# Altium schematic sheet Connectors.SchDoc: Connectors
size A4; Revision: 1.0; SheetNumber: 2; SheetTotal: 11; Class: B
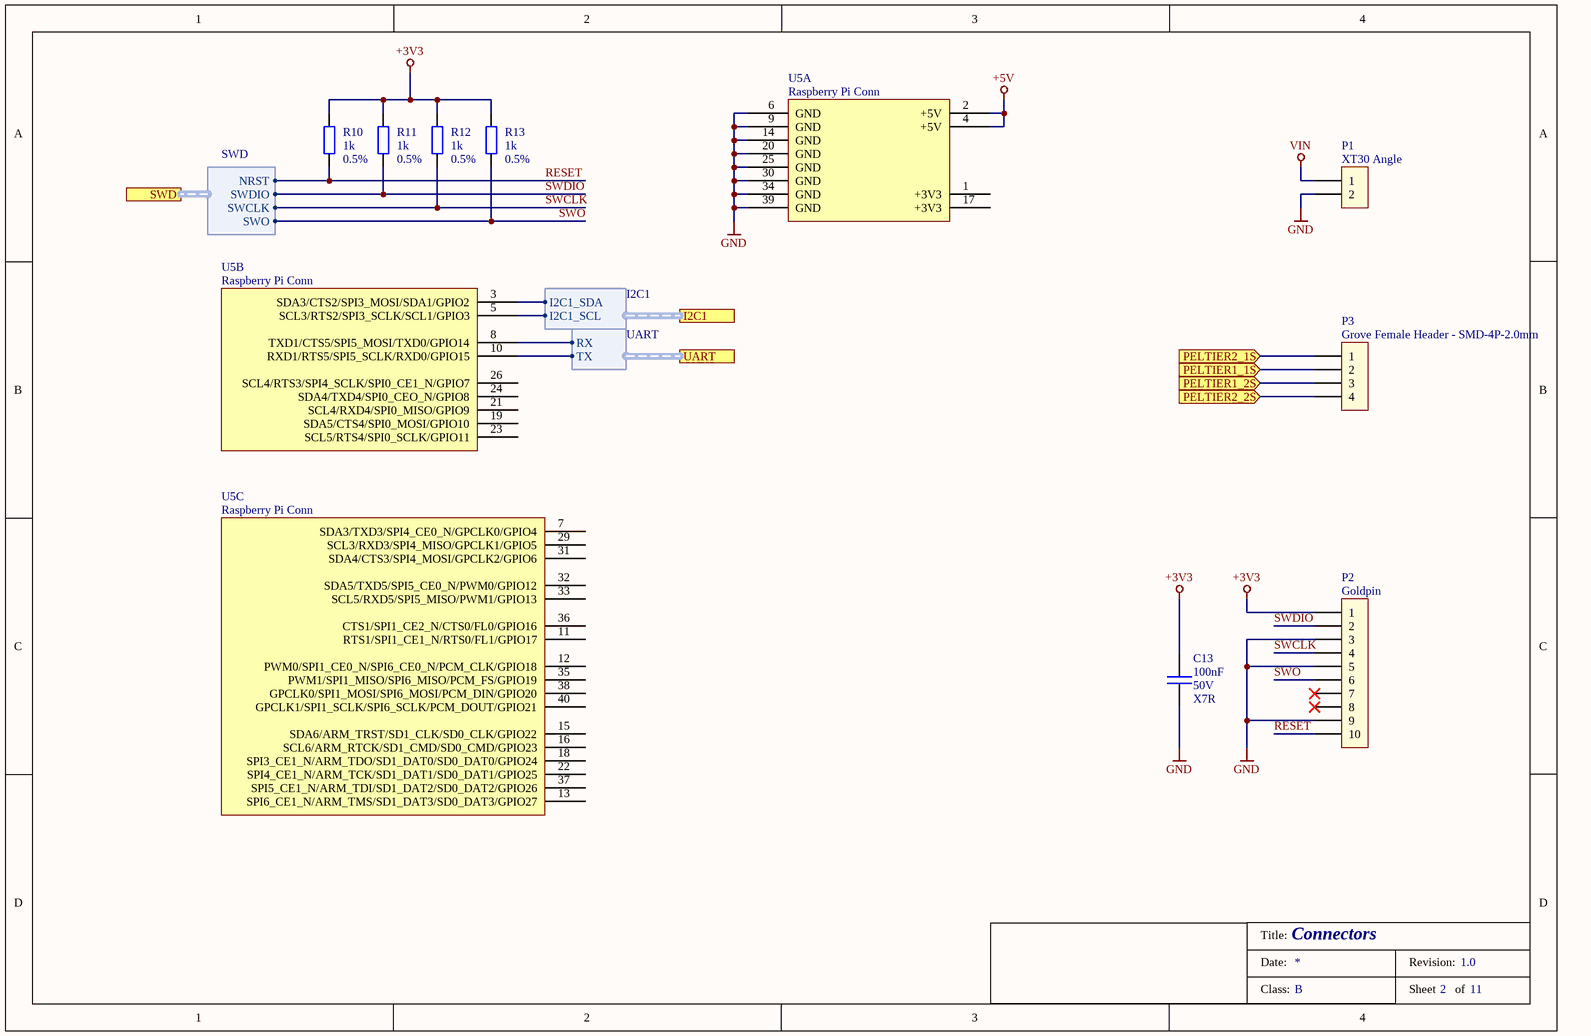
[diagram p0: Connectors.SchDoc]

## Parts
C13  value 100nF  Voltage: 50V  Dielectric: X7R  [C_0603]  (hidden comment: C)
P1  P_Header_2  [XT30_ANGL]  (value not drawn)
P2  P_Header_10  [CONN_M50_3610542]  (value not drawn)
P3  P_Header_4  [CONN_114020164]  (value not drawn)
R10  value 1k  Tolerance: 0.5%  [R_0402]  (hidden comment: R)
R11  value 1k  Tolerance: 0.5%  [R_0402]  (hidden comment: R)
R12  value 1k  Tolerance: 0.5%  [R_0402]  (hidden comment: R)
R13  value 1k  Tolerance: 0.5%  [R_0402]  (hidden comment: R)
U5  value Raspberry Pi Conn  [CONN_Raspberry_Pi]  (hidden comment: M_Raspberry_Pi_4B)  (parts A,B,C of 3)

## Ports
I2C1 (harness I2C1), PELTIER1_1S (in), PELTIER1_2S (in), PELTIER2_1S (in), PELTIER2_2S (in), SWD (harness SWD), UART (harness UART)

## Harnesses
SWD: NRST, SWDIO, SWCLK, SWO
UART: TX, RX
I2C1: I2C1_SCL, I2C1_SDA

## Nets
+3V3: C13.1 P2.1 R10.1 R11.1 R12.1 R13.1
+5V: U5.2(+5V) U5.4(+5V)
GND: C13.2 P1.2 P2.3 P2.5 P2.9 U5.6(GND) U5.9(GND) U5.14(GND) U5.20(GND) U5.25(GND) U5.30(GND) U5.34(GND) U5.39(GND)
VIN: P1.1
PELTIER1_1S: P3.2 ; port PELTIER1_1S
PELTIER1_2S: P3.3 ; port PELTIER1_2S
PELTIER2_1S: P3.1 ; port PELTIER2_1S
PELTIER2_2S: P3.4 ; port PELTIER2_2S
RESET: P2.10 R10.2 ; port SWD.NRST
SWCLK: P2.4 R12.2 ; port SWD.SWCLK
SWDIO: P2.2 R11.2 ; port SWD.SWDIO
SWO: P2.6 R13.2 ; port SWD.SWO
NetU5_3: U5.3(SDA3/CTS2/SPI3_MOSI/SDA1/GPIO2) ; port I2C1.I2C1_SDA
NetU5_5: U5.5(SCL3/RTS2/SPI3_SCLK/SCL1/GPIO3) ; port I2C1.I2C1_SCL
NetU5_8: U5.8(TXD1/CTS5/SPI5_MOSI/TXD0/GPIO14) ; port UART.RX
NetU5_10: U5.10(RXD1/RTS5/SPI5_SCLK/RXD0/GPIO15) ; port UART.TX

Not connected (* = marked no-connect by the designer): P2 7* 8*; U5 1(+3V3) 7(SDA3/TXD3/SPI4_CE0_N/GPCLK0/GPIO4) 11(RTS1/SPI1_CE1_N/RTS0/FL1/GPIO17) 12(PWM0/SPI1_CE0_N/SPI6_CE0_N/PCM_CLK/GPIO18) 13(SPI6_CE1_N/ARM_TMS/SD1_DAT3/SD0_DAT3/GPIO27) 15(SDA6/ARM_TRST/SD1_CLK/SD0_CLK/GPIO22) 16(SCL6/ARM_RTCK/SD1_CMD/SD0_CMD/GPIO23) 17(+3V3) 18(SPI3_CE1_N/ARM_TDO/SD1_DAT0/SD0_DAT0/GPIO24) 19(SDA5/CTS4/SPI0_MOSI/GPIO10) 21(SCL4/RXD4/SPI0_MISO/GPIO9) 22(SPI4_CE1_N/ARM_TCK/SD1_DAT1/SD0_DAT1/GPIO25) 23(SCL5/RTS4/SPI0_SCLK/GPIO11) 24(SDA4/TXD4/SPI0_CEO_N/GPIO8) 26(SCL4/RTS3/SPI4_SCLK/SPI0_CE1_N/GPIO7) 29(SCL3/RXD3/SPI4_MISO/GPCLK1/GPIO5) 31(SDA4/CTS3/SPI4_MOSI/GPCLK2/GPIO6) 32(SDA5/TXD5/SPI5_CE0_N/PWM0/GPIO12) 33(SCL5/RXD5/SPI5_MISO/PWM1/GPIO13) 35(PWM1/SPI1_MISO/SPI6_MISO/PCM_FS/GPIO19) 36(CTS1/SPI1_CE2_N/CTS0/FL0/GPIO16) 37(SPI5_CE1_N/ARM_TDI/SD1_DAT2/SD0_DAT2/GPIO26) 38(GPCLK0/SPI1_MOSI/SPI6_MOSI/PCM_DIN/GPIO20) 40(GPCLK1/SPI1_SCLK/SPI6_SCLK/PCM_DOUT/GPIO21)

## Notes on the sheet
- Title:
- Date:
- Revision:
- Class:
- Sheet
- of

## Library data of the parts
C13 = C_100nF_50V_0603: Capacitor; Manufacturer: Kemet; Manufacturer Part Number: C0603T104K5RCL7136; Tmax: 125; Tmin: -55; Grade: 2; Fail Rate: A; Tolerance: 10%; Part Number: C_100nF_50V_0603; HelpURL: https://content.kemet.com/datasheets/KEM_C1027_X7R_COTS_SMD.pdf; Supplier 1: Digi-Key; Supplier Part Number 1: 399-6305-1-ND; Status: Active
P1 = XT30-ANGLE: XT30 Angle; Manufacturer: DFRobot; Manufacturer Part Number: XT30PW-M; Grade: 3; Value: XT30 Angle; Desc: XT30 Angle; Part Number: XT30-ANGLE; HelpURL: https://www.tme.eu/Document/6eb2005a51a52592b3f19e8a450c54c8/XT30PW-M.pdf; Supplier 1: TME; Supplier Part Number 1: XT30PW-M; Status: Active
P2 = M50-3610542: Goldpin; Manufacturer: Harwin; Tmax: 105; Tmin: -40; Grade: 3; Value: M50-3610542; Desc: Goldpin; Part Number: M50-3610542; HelpURL: https://cdn.harwin.com/pdfs/M50-361.pdf; Manufacturer Part Number: M50-3610542; Supplier 1: Mouser; Supplier Part Number 1: 855-M50-3610542; Status: Active
P3 = 114020164: Grove Female Header - SMD-4P-2.0mm; Manufacturer: SEEED; Grade: 3; Value: 114020164; Desc: Grove Female Header - SMD-4P-2.0mm; Part Number: 114020164; HelpURL: https://files.seeedstudio.com/products/114020164/res/Grove%20Female%20Header%20-%20SMD-4P-2.0mm-90D%20Datasheet.pdf; Manufacturer Part Number: 114020164; Supplier 1: Mouser; Supplier Part Number 1: 713-114020164; Status: Active
R10-R13 = R_1k_50V_0402: Manufacturer: Vishay; Manufacturer Part Number: MCS0402PD1001DE500; Voltage: 50V; RMS Power: 0.2W; TCR: 25ppm; Tmax: 175; Tmin: -55; Grade: 2; Part Number: R_1k_50V_0402; HelpURL: https://www.vishay.com/docs/28916/mcxhp.pdf; Supplier 2: Mouser; Supplier Part Number 2: 594-MCS0402PD1001DP5; Supplier 1: Digi-Key; Supplier Part Number 1: 749-1511-1-ND; Status: Active
U5 = CONN_Raspberry_Pi: Raspberry Pi female connector; Manufacturer: TE Connectivity; Manufacturer Part Number: 1-534998-0; Tmax: 105; Tmin: -65; Grade: 3; Part Number: CONN_Raspberry_Pi; HelpURL: https://www.te.com/commerce/DocumentDelivery/DDEController?Action=showdoc&DocId=Specification+Or+Standard%7F114-25018%7FE%7Fpdf%7FEnglish%7FENG_SS_114-25018_E.pdf%7F1-534998-0; Supplier 1: Mouser; Supplier Part Number 1: 571-1534998; Status: Active